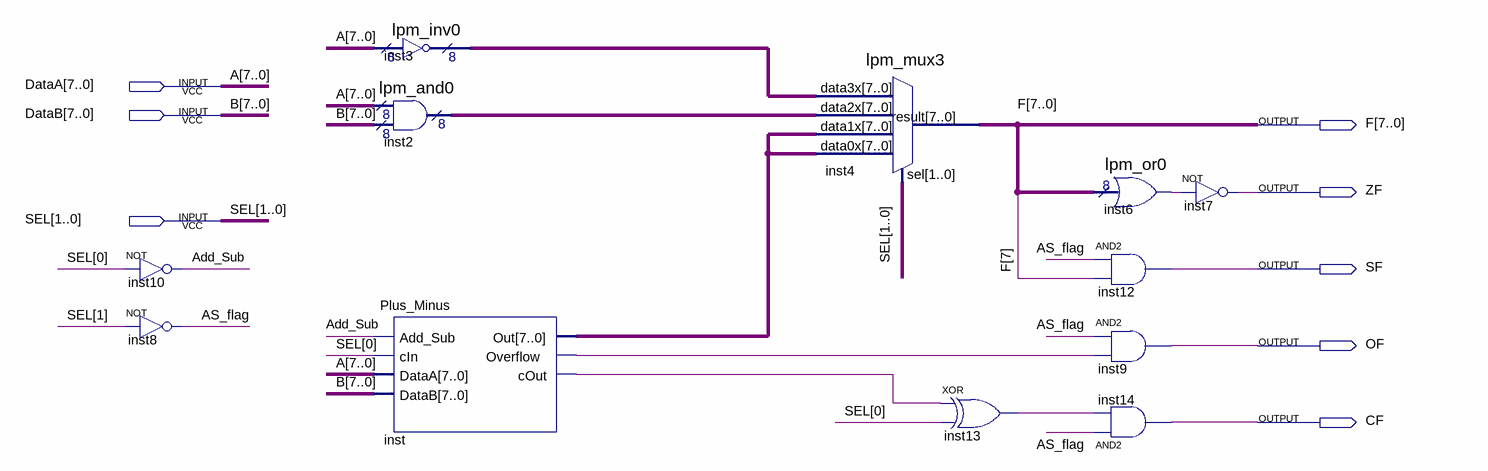
[diagram p0: schematic sheet]
// Quartus schematic ALU.bdf as structural Verilog: 12 symbols, 8 pins
module ALU (
  input  [7:0] DataA,
  input  [7:0] DataB,
  input  [1:0] SEL,
  output [7:0] F,
  output ZF,
  output SF,
  output OF,
  output CF
);

  wire Add_Sub, AS_flag, inst6_result, inst13_out, inst_cout, inst_overflow;
  wire [7:0] inst2_result, inst3_result, inst_out;

  not inst10 (Add_Sub, SEL[0]);
  not inst8 (AS_flag, SEL[1]);
  lpm_inv0 inst3 (.data(DataA), .result(inst3_result));
  lpm_and0 inst2 (.data0x(DataA), .data1x(DataB), .result(inst2_result));
  Plus_Minus inst (
    .Add_Sub(Add_Sub), .cIn(SEL[0]), .DataA(DataA), .DataB(DataB), .Out(inst_out), .Overflow(inst_overflow),
    .cOut(inst_cout));
  lpm_mux3 inst4 (
    .data3x(inst3_result), .data2x(inst2_result), .data1x(inst_out), .data0x(inst_out), .sel(SEL), .result(F));
  xor inst13 (inst13_out, inst_cout, SEL[0]);
  lpm_or0 inst6 (.data(F), .result(inst6_result));
  and inst12 (SF, AS_flag, F[7]);
  and inst9 (OF, AS_flag, inst_overflow);
  and inst14 (CF, AS_flag, inst13_out);
  not inst7 (ZF, inst6_result);

  // Other names for the same wires on the sheet: A[7:0] = DataA; B[7:0] = DataB
endmodule
